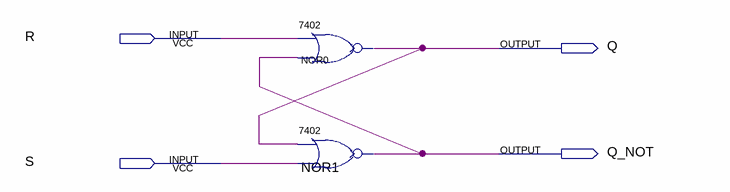
[diagram p0: schematic sheet]
// Quartus schematic sr_latch.bdf as structural Verilog: 2 symbols, 4 pins
module sr_latch (
  input  R,
  input  S,
  output Q,
  output Q_NOT
);

  \7402  NOR0 (.\2 (R), .\3 (Q_NOT), .\1 (Q));
  \7402  NOR1 (.\2 (Q), .\3 (S), .\1 (Q_NOT));
endmodule
